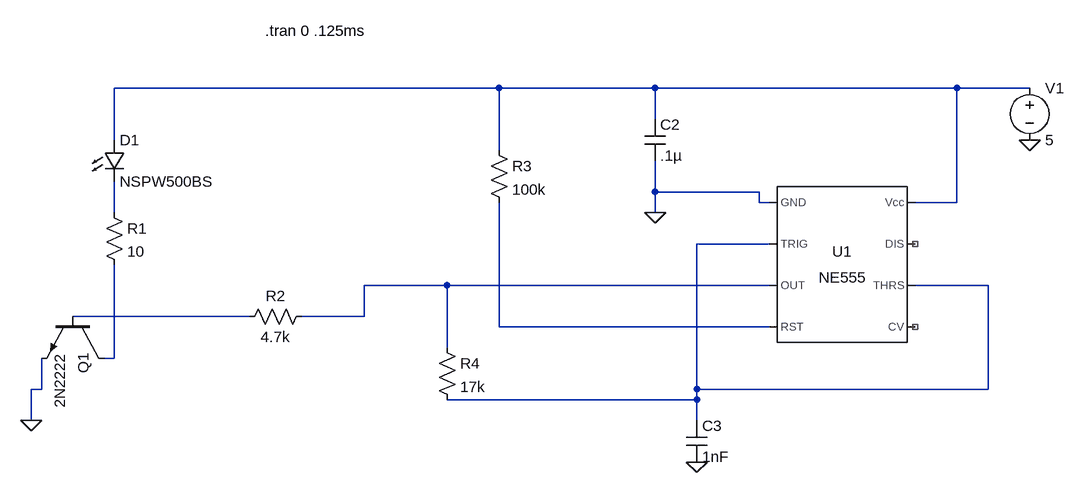
[diagram p0: schematic Independent Assignment.asc]
Independent Assignment.asc, the LTspice schematic file:
Version 4
SHEET 1 880 752
WIRE -64 64 -656 64
WIRE 176 64 -64 64
WIRE 640 64 176 64
WIRE 752 64 640 64
WIRE 176 112 176 64
WIRE -656 144 -656 64
WIRE -64 160 -64 64
WIRE 176 224 176 176
WIRE 336 224 176 224
WIRE 336 240 336 224
WIRE 352 240 336 240
WIRE 640 240 640 64
WIRE 640 240 576 240
WIRE -656 256 -656 208
WIRE 176 256 176 224
WIRE 352 304 240 304
WIRE -144 368 -272 368
WIRE 352 368 -144 368
WIRE 688 368 576 368
WIRE -448 416 -720 416
WIRE -272 416 -272 368
WIRE -272 416 -368 416
WIRE -64 432 -64 240
WIRE 352 432 -64 432
WIRE -144 464 -144 368
WIRE -656 480 -656 336
WIRE -656 480 -672 480
WIRE -768 528 -768 480
WIRE -768 528 -784 528
WIRE 240 528 240 304
WIRE 688 528 688 368
WIRE 688 528 240 528
WIRE 240 544 240 528
WIRE 240 544 -144 544
WIRE -784 576 -784 528
WIRE 240 576 240 544
FLAG -784 576 0
FLAG 240 640 0
FLAG 752 144 0
FLAG 176 256 0
SYMBOL Misc/NE555 464 336 R0
SYMATTR InstName U1
SYMBOL LED -672 144 R0
SYMATTR InstName D1
SYMATTR Value NSPW500BS
SYMBOL res -672 240 R0
SYMATTR InstName R1
SYMATTR Value 10
SYMBOL res -352 400 R90
WINDOW 0 0 56 VBottom 2
WINDOW 3 32 56 VTop 2
SYMATTR InstName R2
SYMATTR Value 4.7k
SYMBOL npn -672 416 R90
SYMATTR InstName Q1
SYMATTR Value 2N2222
SYMBOL res -80 144 R0
SYMATTR InstName R3
SYMATTR Value 100k
SYMBOL cap 160 112 R0
SYMATTR InstName C2
SYMATTR Value .1µ
SYMBOL cap 224 576 R0
SYMATTR InstName C3
SYMATTR Value 1nF
SYMBOL voltage 752 48 R0
SYMATTR InstName V1
SYMATTR Value 5
SYMBOL res -160 448 R0
SYMATTR InstName R4
SYMATTR Value 17k
TEXT -424 -24 Left 2 !.tran 0 .125ms

The netlist it stands for:
* Independent Assignment.asc
XU1 0 N003 N004 N006 NC_01 N003 NC_02 N001 NE555  ; pins GND TRIG OUT RST CV THRS DIS Vcc
D1 N001 N002 NSPW500BS
R1 N002 N007 10
R2 N004 N005 4.7k
Q1 N007 N005 0 0 2N2222
R3 N001 N006 100k
C2 N001 0 .1µ
C3 N003 0 1nF
V1 N001 0 5
R4 N004 N003 17k
.model D D
.lib standard.dio
.model NPN NPN
.model PNP PNP
.lib standard.bjt
.tran 0 .125ms
.lib NE555.sub
.backanno
.end